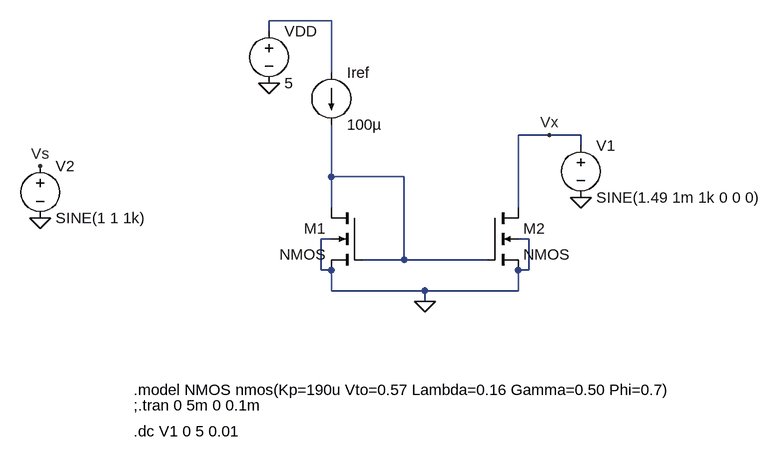
[diagram p0: schematic Basic current mirror.asc]
Basic current mirror.asc, the LTspice schematic file:
Version 4
SHEET 1 880 712
WIRE 80 64 -16 64
WIRE -16 80 -16 64
WIRE 80 144 80 64
WIRE 416 240 368 240
WIRE 464 240 416 240
WIRE 464 256 464 240
WIRE 80 304 80 224
WIRE 192 304 80 304
WIRE 80 352 80 304
WIRE 368 352 368 240
WIRE 80 400 64 400
WIRE 384 400 368 400
WIRE 192 432 192 304
WIRE 192 432 128 432
WIRE 320 432 192 432
WIRE 64 448 64 400
WIRE 80 448 64 448
WIRE 384 448 384 400
WIRE 384 448 368 448
WIRE 80 480 80 448
WIRE 224 480 80 480
WIRE 368 480 368 448
WIRE 368 480 224 480
WIRE 224 496 224 480
FLAG -16 160 0
FLAG 224 496 0
FLAG 464 336 0
FLAG 416 240 Vx
FLAG -368 368 0
FLAG -368 288 Vs
SYMBOL nmos4 128 352 M0
SYMATTR InstName M1
SYMBOL nmos4 320 352 R0
SYMATTR InstName M2
SYMBOL current 80 144 R0
WINDOW 123 0 0 Left 0
WINDOW 39 0 0 Left 0
SYMATTR InstName Iref
SYMATTR Value 100µ
SYMBOL voltage -16 64 R0
WINDOW 123 0 0 Left 0
WINDOW 39 0 0 Left 0
SYMATTR InstName VDD
SYMATTR Value 5
SYMBOL voltage 464 240 R0
WINDOW 123 0 0 Left 0
WINDOW 39 0 0 Left 0
SYMATTR InstName V1
SYMATTR Value SINE(1.49 1m 1k 0 0 0)
SYMBOL voltage -368 272 R0
WINDOW 123 0 0 Left 0
WINDOW 39 0 0 Left 0
SYMATTR InstName V2
SYMATTR Value SINE(1 1 1k)
TEXT -224 632 Left 2 !.model NMOS nmos(Kp=190u Vto=0.57 Lambda=0.16 Gamma=0.50 Phi=0.7)
TEXT -224 696 Left 2 !.dc V1 0 5 0.01
TEXT -224 656 Left 2 !;.tran 0 5m 0 0.1m

The netlist it stands for:
* Basic current mirror.asc
M1 N002 N002 0 0 NMOS
M2 Vx N002 0 0 NMOS
Iref N001 N002 100µ
VDD N001 0 5
V1 Vx 0 SINE(1.49 1m 1k 0 0 0)
V2 Vs 0 SINE(1 1 1k)
.model NMOS NMOS
.model PMOS PMOS
.lib standard.mos
.model NMOS nmos(Kp=190u Vto=0.57 Lambda=0.16 Gamma=0.50 Phi=0.7)
.dc V1 0 5 0.01
;.tran 0 5m 0 0.1m
.backanno
.end